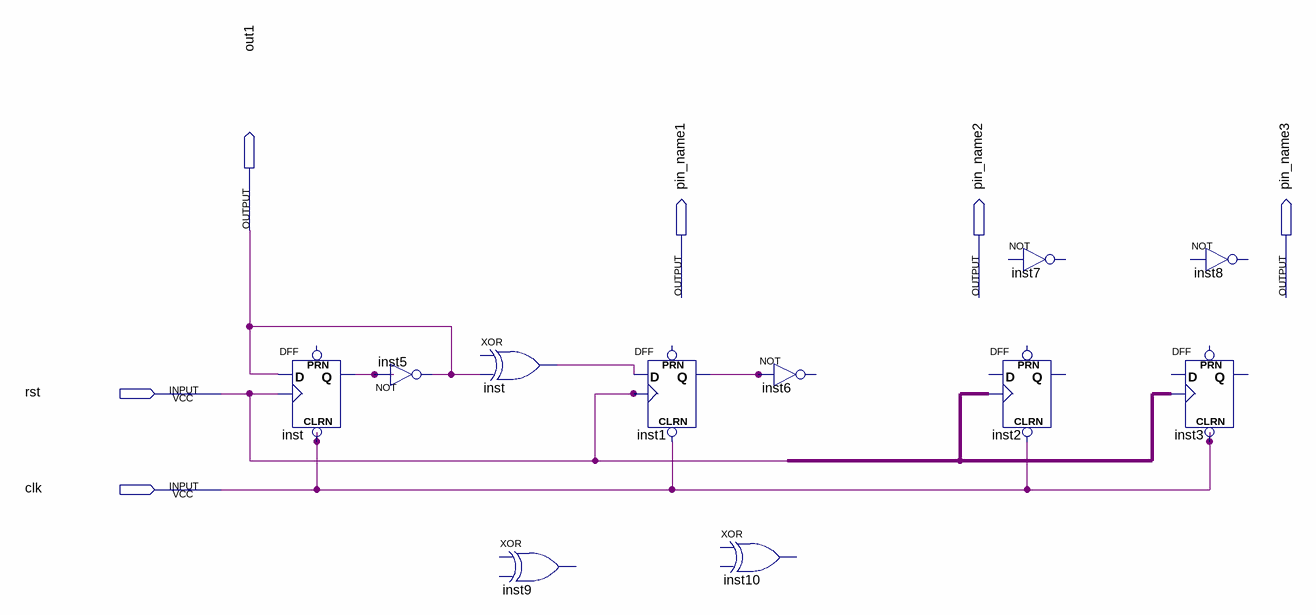
[diagram p0: schematic sheet]
// Quartus schematic downCounterBlock_unfinished.bdf as structural Verilog: 11 symbols, 6 pins
module downCounterBlock_unfinished (
  input  rst,
  input  clk,
  output out1,
  output pin_name1,
  output pin_name2,
  output pin_name3
);

  wire inst1_q, inst_out, inst_q, undriven;

  DFF inst (.CLRN(clk), .CLK(rst), .D(out1), .Q(inst_q));  // open: PRN
  not inst5 (out1, inst_q);
  buf inst_dup2 (inst_out, out1);  // XOR open: IN1
  // XOR inst9 is placed but not wired
  DFF inst1 (.CLRN(clk), .CLK(rst), .D(inst_out), .Q(inst1_q));  // open: PRN
  // NOT inst6 has open pins: IN=inst1_q, OUT=open
  // XOR inst10 is placed but not wired
  DFF inst2 (.CLRN(clk), .CLK(undriven));  // open: D, PRN, Q
  // NOT inst7 is placed but not wired
  // NOT inst8 is placed but not wired
  DFF inst3 (.CLRN(clk), .CLK(undriven));  // open: D, PRN, Q
endmodule
